# Altium schematic sheet PGA.SchDoc
size A4
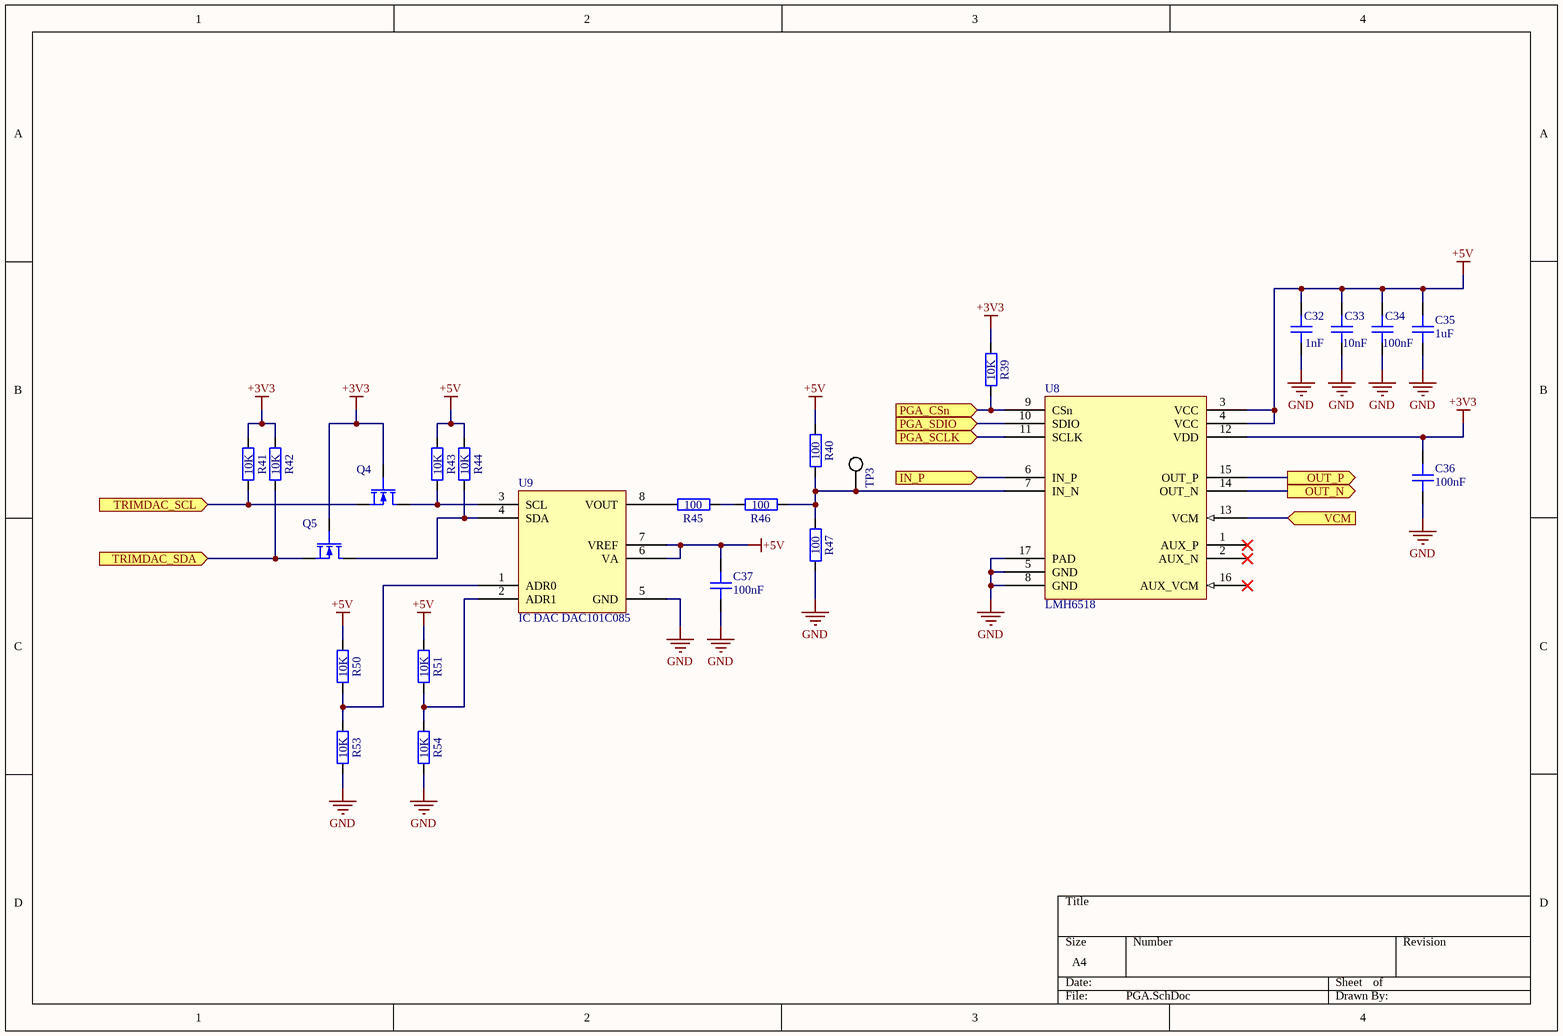
[diagram p0: PGA.SchDoc]

## Parts
C32  value 1nF  [GEN_C_0402]  (hidden comment: CAP 1nF 50V X7R 0402)
C33  value 10nF  [GEN_C_0402]  (hidden comment: CAP 10nF 50V X7R 0402)
C34  value 100nF  [GEN_C_0402]  (hidden comment: CAP 100nF 16V X7R 0402)
C35  value 1uF  [GEN_C_0402]  (hidden comment: CAP 1uF 25V X5R 0402)
C36  value 100nF  [GEN_C_0402]  (hidden comment: CAP 100nF 16V X7R 0402)
C37  value 100nF  [GEN_C_0402]  (hidden comment: CAP 100nF 16V X7R 0402)
Q4  NMOS DMN62D0UW  [GEN_SOT_323]  (value not drawn)
Q5  NMOS DMN62D0UW  [GEN_SOT_323]  (value not drawn)
R39  value 10K  [GEN_R_0402]  (hidden comment: RES 10K OHM 1% 1/10W 0402)
R40  value 100  [GEN_R_0402]  (hidden comment: RES 100 OHM 1% 1/10W 0402)
R41  value 10K  [GEN_R_0402]  (hidden comment: RES 10K OHM 1% 1/10W 0402)
R42  value 10K  [GEN_R_0402]  (hidden comment: RES 10K OHM 1% 1/10W 0402)
R43  value 10K  [GEN_R_0402]  (hidden comment: RES 10K OHM 1% 1/10W 0402)
R44  value 10K  [GEN_R_0402]  (hidden comment: RES 10K OHM 1% 1/10W 0402)
R45  value 100  [GEN_R_0402]  (hidden comment: RES 100 OHM 1% 1/10W 0402)
R46  value 100  [GEN_R_0402]  (hidden comment: RES 100 OHM 1% 1/10W 0402)
R47  value 100  [GEN_R_0402]  (hidden comment: RES 100 OHM 1% 1/10W 0402)
R50  value 10K  [GEN_R_0402]  (hidden comment: RES 10K OHM 1% 1/10W 0402)
R51  value 10K  [GEN_R_0402]  (hidden comment: RES 10K OHM 1% 1/10W 0402)
R53  value 10K  [GEN_R_0402]  (hidden comment: RES 10K OHM 1% 1/10W 0402)
R54  value 10K  [GEN_R_0402]  (hidden comment: RES 10K OHM 1% 1/10W 0402)
TP3  5019  [KEY_5019]  (value not drawn)
U8  LMH6518  [TI_WQFN_RGH0016A]
U9  IC DAC DAC101C085  [TI_VSSOP8_DGK]

## Ports
IN_P (in), OUT_N (out), OUT_P (out), PGA_CSn (in), PGA_SCLK (in), PGA_SDIO (in), TRIMDAC_SCL (in), TRIMDAC_SDA (in), VCM (in)

## Nets
+3V3: C36.2 Q4.2(G) Q5.2(G) R39.2 R41.2 R42.2 U8.12(VDD)
+5V: C32.2 C33.2 C34.2 C35.2 C37.2 R40.2 R43.2 R44.2 R50.2 R51.2 U8.3(VCC) U8.4(VCC) U9.6(VA) U9.7(VREF)
GND: C32.1 C33.1 C34.1 C35.1 C36.1 C37.1 R47.1 R53.1 R54.1 U8.5(GND) U8.8(GND) U8.17(PAD) U9.5(GND)
IN_P: U8.6(IN_P) ; port IN_P
OUT_N: U8.14(OUT_N) ; port OUT_N
OUT_P: U8.15(OUT_P) ; port OUT_P
PGA_CSn: R39.1 U8.9(CSn) ; port PGA_CSn
PGA_SCLK: U8.11(SCLK) ; port PGA_SCLK
PGA_SDIO: U8.10(SDIO) ; port PGA_SDIO
TRIMDAC_SCL: Q4.3(S) R41.1 ; port TRIMDAC_SCL
TRIMDAC_SDA: Q5.3(S) R42.1 ; port TRIMDAC_SDA
VCM: U8.13(VCM) ; port VCM
NetQ4_1: Q4.1(D) R43.1 U9.3(SCL)
NetQ5_1: Q5.1(D) R44.1 U9.4(SDA)
NetR40_1: R40.1 R46.1 R47.2 TP3.1 U8.7(IN_N)
NetR45_1: R45.1 R46.2
NetR45_2: R45.2 U9.8(VOUT)
NetR50_1: R50.1 R53.2 U9.1(ADR0)
NetR51_1: R51.1 R54.2 U9.2(ADR1)

Not connected (* = marked no-connect by the designer): U8 1(AUX_P)* 2(AUX_N)* 16(AUX_VCM)*

## Library data of the parts
Q4 Q5 = NMOS DMN62D0UW: Vdss: 60V; Id: 340mA; Max Power: 320mW; Supplier 1: Digi-Key; Supplier Part Number 1: DMN62D0UW-7DICT-ND
R39 R41-R44 R50 R51 R53 R54 = RES 10K OHM 1% 1/10W 0402: Power Rating: 0.1W; Tolerance: 1%; Package: 0402; Supplier 1: Digi-Key; Supplier Part Number 1: P10.0KLCT-ND
R40 R45-R47 = RES 100 OHM 1% 1/10W 0402: Power Rating: 0.1W; Tolerance: 1%; Package: 0402; Supplier 1: Digi-Key; Supplier Part Number 1: P100LCT-ND
TP3 = TP KEYSTONE 5019: Supplier 1: Digi-Key; Supplier Part Number 1: 36-5019CT-ND
U8 = IC PGA LMH6518: Supplier 1: Digi-Key; Supplier Part Number 1: LMH6518SQE/NOPBCT-ND
C32 = CAP 1nF 50V X7R 0402: Package: 0402; Voltage Rating: 50V; Supplier 1: Digi-Key; Supplier Part Number 1: 490-4761-1-ND
C33 = CAP 10nF 50V X7R 0402: Package: 0402; Voltage Rating: 50V; Supplier 1: Digi-Key; Supplier Part Number 1: 490-4762-1-ND
C34 C36 C37 = CAP 100nF 16V X7R 0402: Package: 0402; Voltage Rating: 16V; Supplier 1: Digi-Key; Supplier Part Number 1: 490-4759-1-ND
C35 = CAP 1uF 25V X5R 0402: Package: 0402; Voltage Rating: 25V; Supplier 1: Digi-Key; Supplier Part Number 1: 490-10017-1-ND
U9 = IC DAC DAC101C085: Supplier 1: Digi-Key; Supplier Part Number 1: DAC101C085CIMM/NOPBCT-ND